# EasyEDA Pro project FlasherPanel.epro

# Schematic Schematic1
Board Name: Board1; Create Date: 2025-02-24; Page Name: P1; Project Name: FlasherBoard; Schematic Name: Schematic1; Update Date: 2025-02-25; Company: EasyEDA.com; Page Size: A4; Version: V1.0
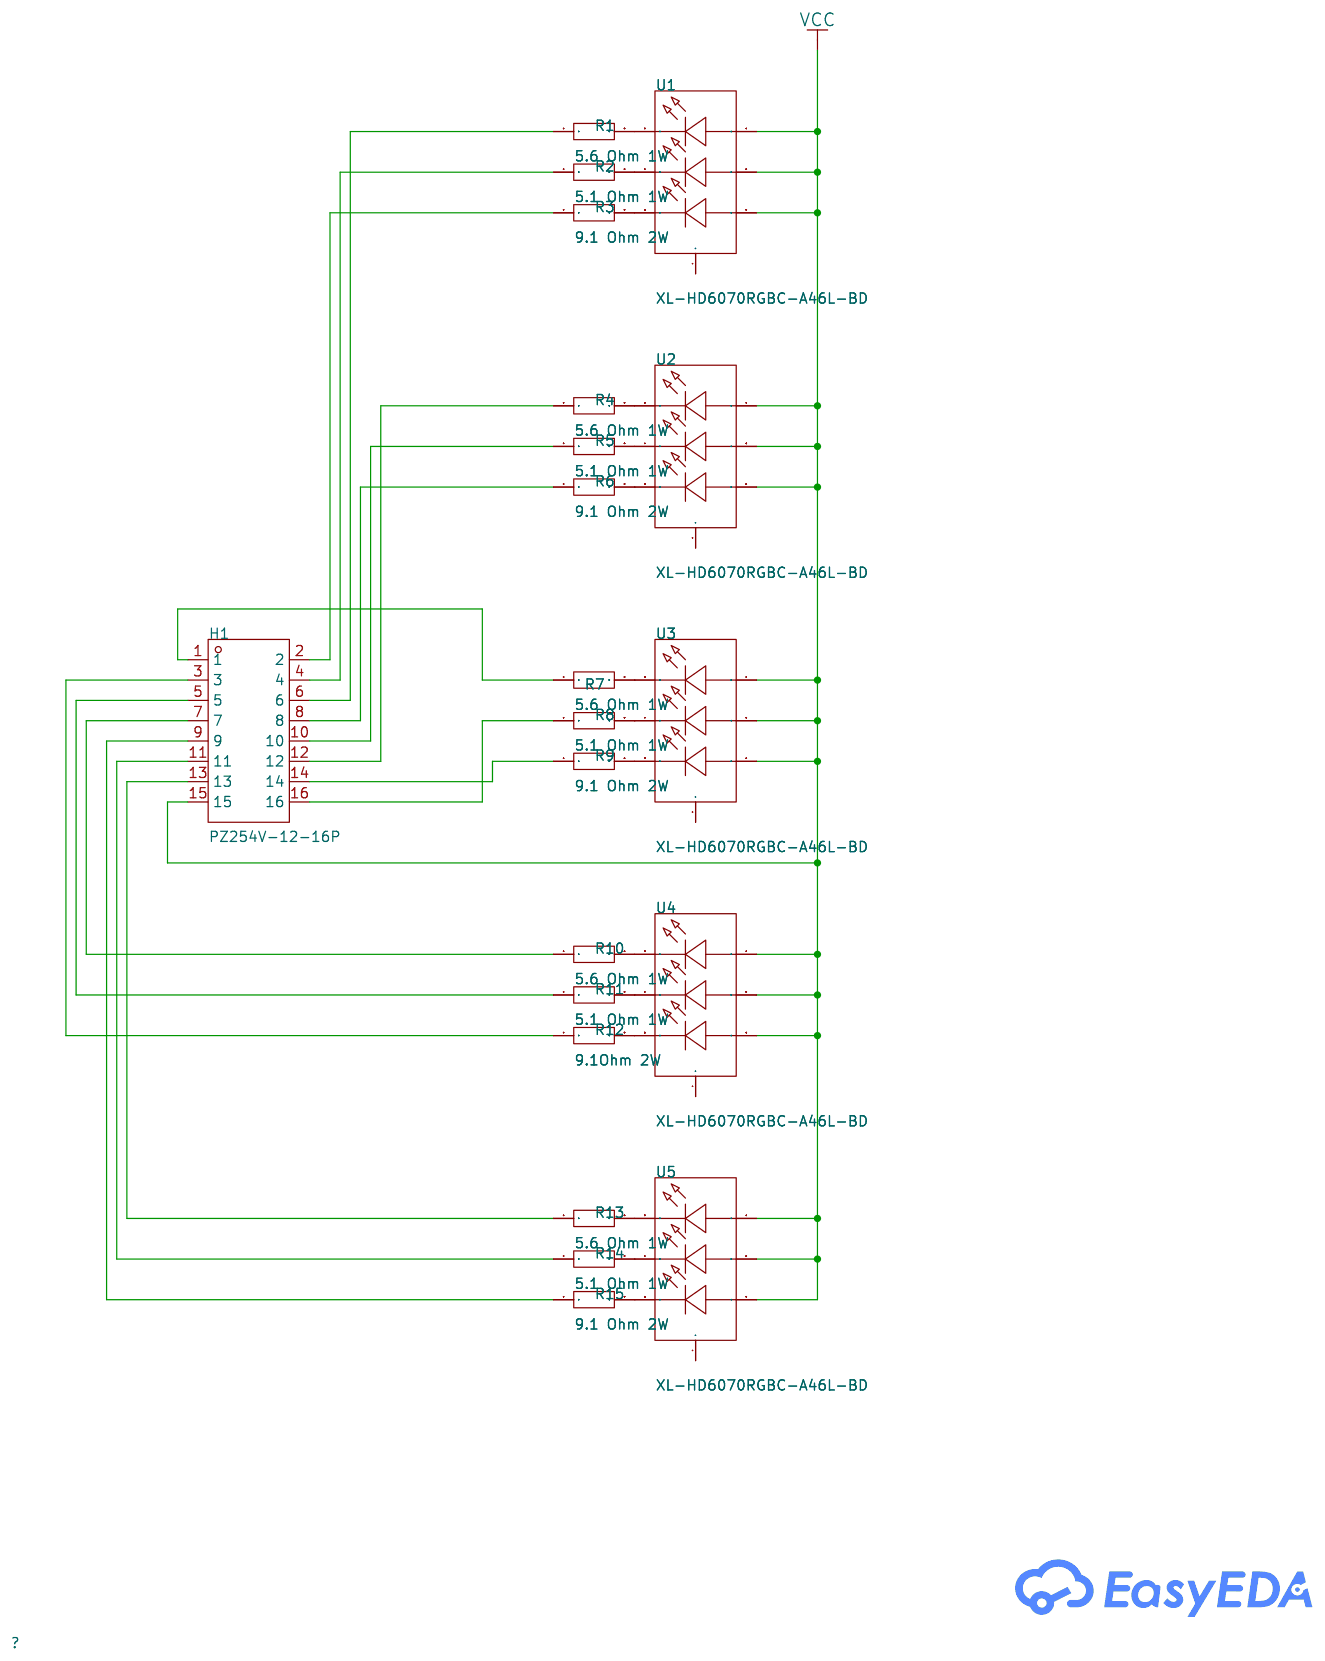
[diagram p0: schematic sheet]

## Parts
H1  PZ254V-12-16P  [HDR-TH_16P-P2.54-V-M-R2-C8-S2.54]
R1  5.6 Ohm 1W  [R2512]
R2  5.1 Ohm 1W  [R2512]
R3  9.1 Ohm 2W  [R2512]
R4  5.6 Ohm 1W  [R2512]
R5  5.1 Ohm 1W  [R2512]
R6  9.1 Ohm 2W  [R2512]
R7  5.6 Ohm 1W  [R2512]
R8  5.1 Ohm 1W  [R2512]
R9  9.1 Ohm 2W  [R2512]
R10  5.6 Ohm 1W  [R2512]
R11  5.1 Ohm 1W  [R2512]
R12  9.1Ohm 2W  [R2512]
R13  5.6 Ohm 1W  [R2512]
R14  5.1 Ohm 1W  [R2512]
R15  9.1 Ohm 2W  [R2512]
U1  XL-HD6070RGBC-A46L-BD  [LED-SMD_6P-BD8.0-LS14.5]
U2  XL-HD6070RGBC-A46L-BD  [LED-SMD_6P-BD8.0-LS14.5]
U3  XL-HD6070RGBC-A46L-BD  [LED-SMD_6P-BD8.0-LS14.5]
U4  XL-HD6070RGBC-A46L-BD  [LED-SMD_6P-BD8.0-LS14.5]
U5  XL-HD6070RGBC-A46L-BD  [LED-SMD_6P-BD8.0-LS14.5]

## Library data of the parts
H1 = PZ254V-12-16P: Pin Structure:2x8P Pitch:2.54mm Row Spacing:2.54mm Circluar Pins/Square Pins:Square Pins Mounting Type:Straight Number of Rows:双排 Number of Pins:16P Current Rating (Max):- Voltage Rating (Max):- Length of Mating Pin:6mm Insulation Height:2.5mm Length of E; LCSC Part Name: 间距:2.54mm 2x8P 直插 方针; Supplier Part: C492425; Manufacturer: XFCN(兴飞); Supplier Footprint: 插件,P=2.54mm; JLCPCB Part Class: Extended Part; Datasheet: https://atta.szlcsc.com/upload/public/pdf/source/20200309/C492425_0A00EE06259AD0A0AB9C88167BB69964.pdf; Supplier: LCSC; Pin Structure: 2x8P; Pitch: 2.54mm; Row Spacing: 2.54mm; Circluar Pins/Square Pins: Square Pins; Mounting Type: Straight; Number of Rows: 双排; Number of Pins: 16P; Length of Mating Pin: 6mm; Insulation Height: 2.5mm; Length of End Connection Pin: 3mm; Operating Temperature Range: -40℃~+105℃; Color: Black
R1-R3 = Res_0603: Supplier Footprint: 0603
R4-R15 = CRG1206F10K: Type:Thick Film Resistors Resistance: Tolerance:±1% Tolerance:±1% Power(Watts):250mW Overload Voltage (Max): Temperature Coefficient:±100ppm/℃ Temperature Coefficient:±100ppm/℃ Operating Temperature Range:-55℃~+155℃ Operating Temperature Range:-55℃~+155℃; LCSC Part Name: 厚膜电阻 10kΩ ±1% 250mW; Supplier Part: C2074481; Manufacturer: TE Connectivity(泰科电子); Supplier Footprint: 1206; JLCPCB Part Class: Extended Part; Datasheet: https://atta.szlcsc.com/upload/public/pdf/source/20210608/D95D7196C11938F01E5013E79A9A3DFC.pdf; Supplier: LCSC; Type: Thick Film Resistors; Tolerance: ±1%; Power(Watts): 250mW; Temperature Coefficient: ±100ppm/℃; Operating Temperature Range: -55℃~+155℃; FootprintName: R0603
U1-U5 = XL-HD6070RGBC-A46L-BD: LCSC Part Name: 球头七彩; Supplier Part: C22434861; Manufacturer: XINGLIGHT(成兴光); Supplier Footprint: SMD8080-6P; JLCPCB Part Class: Extended Part; Datasheet: https://atta.szlcsc.com/upload/public/pdf/source/20240516/D3778ABDB5CABE9CC0417A8C2EA1DFA9.pdf; Supplier: LCSC

## Nets
VCC: H1.15 U1.1(A) U1.3(A) U1.5(A) U2.1(A) U2.3(A) U2.5(A) U3.1(A) U3.3(A) U3.5(A) U4.1(A) U4.3(A) U4.5(A) U5.1(A) U5.3(A) U5.5(A)
$1N971: R1.2 U1.2(K)
$1N997: R2.2 U1.4(K)
$1N1023: R3.2 U1.6(K)
$1N1049: R4.2 U2.2(K)
$1N1075: R5.2 U2.4(K)
$1N1101: R6.2 U2.6(K)
$1N1151: R8.2 U3.4(K)
$1N1177: R9.2 U3.6(K)
$1N1203: R10.2 U4.2(K)
$1N1229: R11.2 U4.4(K)
$1N1255: R12.2 U4.6(K)
$1N1281: R13.2 U5.2(K)
$1N1307: R14.2 U5.4(K)
$1N1333: R15.2 U5.6(K)
$1N1359: R7.2 U3.2(K)
Net-(H1-1): H1.1 R7.1
Net-(H1-2): H1.2 R3.1
Net-(H1-3): H1.3 R12.1
Net-(H1-4): H1.4 R2.1
Net-(H1-5): H1.5 R11.1
Net-(H1-6): H1.6 R1.1
Net-(H1-7): H1.7 R10.1
Net-(H1-8): H1.8 R6.1
Net-(H1-9): H1.9 R15.1
Net-(H1-10): H1.10 R5.1
Net-(H1-11): H1.11 R14.1
Net-(H1-12): H1.12 R4.1
Net-(H1-13): H1.13 R13.1
Net-(H1-14): H1.14 R9.1
Net-(H1-16): H1.16 R8.1

Not connected (* = marked no-connect by the designer): U1 7; U2 7; U3 7; U4 7; U5 7

# Board PCB1
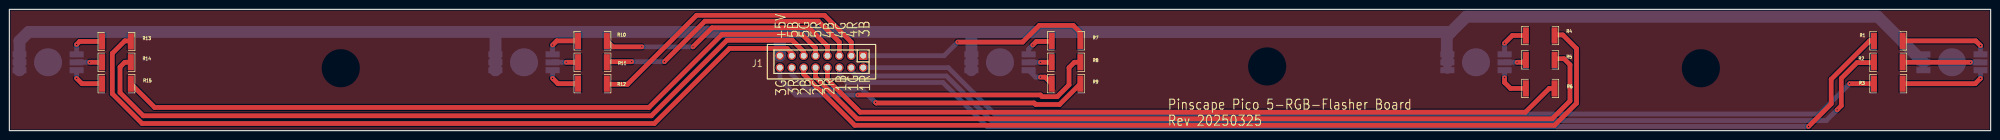
[diagram p1: board, top side]
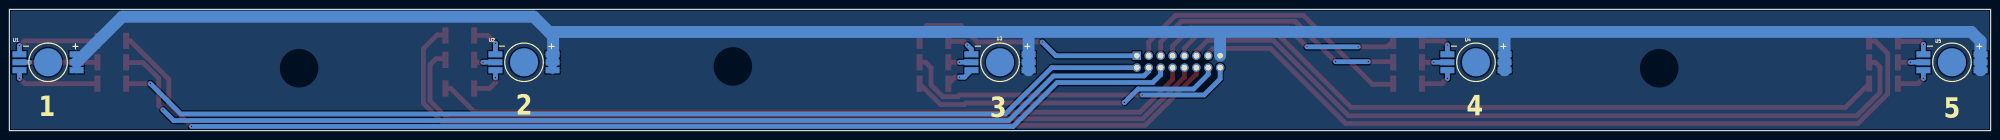
[diagram p2: board, bottom side, seen from below]

Outline 422.91 x 25.91 mm; copper layers: Top Layer, Bottom Layer. Coordinates in mm from the lower left corner of the outline.
Outline path: rectangle 0,25.91 422.91,0
Stack: Top Layer 0.035mm / Dielectric1 1.51mm FR4 er 4.5 / Bottom Layer 0.035mm

## Design rules (mm)
template: JLCPCB Capability(Two Layers Board)
spacing copperThickness1oz (default): track to track 0.102, other pairs 0.152 to 0.3
spacing copperThickness2oz: track to track 0.203, other pairs 0.152 to 0.3
track width copperThickness1oz (default): min 0.127, default 0.254, max 2.54
track width copperThickness2oz: min 0.203, default 0.254, max 2.54
differential pair differentialPair (default): width min 0.127, default 0.254, max 2.54; gap min 0.152, default 0.152
via viaSize (default): diameter min 0.5, default 0.61, max 10; hole min 0.3, default 0.305, max 6.3

## Placement (name value [footprint] x y rotation side)
J1  PZ254V-12-16P  [HDR-TH_16P-P2.54-V-M-R2-C8-S2.54]  173.35 14.73 180 top
R1  5.6 Ohm 1W  [R2512]  401.07 19.18 0 top
R2  5.1 Ohm 1W  [R2512]  401.07 14.6 0 top
R3  9.1 Ohm 2W  [R2512]  401.07 10.03 0 top
R4  5.6 Ohm 1W  [R2512]  326.77 20.32 180 top
R5  5.1 Ohm 1W  [R2512]  326.77 15.11 180 top
R6  9.1 Ohm 2W  [R2512]  326.77 9.02 180 top
R7  5.6 Ohm 1W  [R2512]  225.55 19.18 180 top
R8  5.1 Ohm 1W  [R2512]  225.55 14.6 180 top
R9  9.1 Ohm 2W  [R2512]  225.55 10.03 180 top
R10  5.6 Ohm 1W  [R2512]  124.46 19.18 180 top
R11  5.1 Ohm 1W  [R2512]  124.46 14.6 180 top
R12  9.1Ohm 2W  [R2512]  124.46 10.03 180 top
R13  5.6 Ohm 1W  [R2512]  22.86 19.05 180 top
R14  5.1 Ohm 1W  [R2512]  22.86 14.6 180 top
R15  9.1 Ohm 2W  [R2512]  22.86 10.03 180 top
U1  XL-HD6070RGBC-A46L-BD  [LED-SMD_6P-BD8.0-LS14.5]  414.66 14.6 180 bottom
U2  XL-HD6070RGBC-A46L-BD  [LED-SMD_6P-BD8.0-LS14.5]  313.06 14.6 180 bottom
U3  XL-HD6070RGBC-A46L-BD  [LED-SMD_6P-BD8.0-LS14.5]  211.46 14.6 180 bottom
U4  XL-HD6070RGBC-A46L-BD  [LED-SMD_6P-BD8.0-LS14.5]  109.86 14.6 180 bottom
U5  XL-HD6070RGBC-A46L-BD  [LED-SMD_6P-BD8.0-LS14.5]  8.26 14.6 180 bottom

## Footprints (pads in the part's own frame, mm; a bottom-side part is the same pattern mirrored in y, then rotated)
HDR-TH_16P-P2.54-V-M-R2-C8-S2.54
  rect 1.8x1.8 hole 1.2: 1(-8.89,-1.27)
  round 1.8 hole 1.2: 2(-8.89,1.27) 3(-6.35,-1.27) 4(-6.35,1.27) 5(-3.81,-1.27) 6(-3.81,1.27) 7(-1.27,-1.27) 8(-1.27,1.27) 9(1.27,-1.27) 10(1.27,1.27) 11(3.81,-1.27) 12(3.81,1.27) 13(6.35,-1.27) 14(6.35,1.27) 15(8.89,-1.27) 16(8.89,1.27)
LED-SMD_6P-BD8.0-LS14.5
  rect 3x1.3 smd: 1(6.1,1.7) 2(-6.1,1.7) 3(6.1,0) 4(-6.1,0) 5(6.1,-1.7) 6(-6.1,-1.7)
  round 6 smd: 7(0,0)
R2512
  rect 1.282x3.456 smd: 1(-3.067,0) 2(3.067,0)

## Nets
VCC: J1.15 U1.1 U1.3 U1.5 U2.1 U2.3 U2.5 U3.1 U3.3 U3.5 U4.1 U4.3 U4.5 U5.1 U5.3 U5.5
$1N971: R1.2 U1.2
$1N997: R2.2 U1.4
$1N1023: R3.2 U1.6
$1N1049: R4.2 U2.2
$1N1075: R5.2 U2.4
$1N1101: R6.2 U2.6
$1N1151: R8.2 U3.4
$1N1177: R9.2 U3.6
$1N1203: R10.2 U4.2
$1N1229: R11.2 U4.4
$1N1255: R12.2 U4.6
$1N1281: R13.2 U5.2
$1N1307: R14.2 U5.4
$1N1333: R15.2 U5.6
$1N1359: R7.2 U3.2
$1N2618: J1.2 R3.1
$1N2624: J1.4 R2.1
$1N2631: J1.6 R1.1
$1N2638: J1.12 R4.1
$1N2658: J1.14 R9.1
$1N2665: J1.16 R8.1
$1N2672: J1.1 R7.1
$1N2681: J1.3 R12.1
$1N2688: J1.5 R11.1
$1N2695: J1.7 R10.1
$1N2713: J1.9 R15.1
$1N2719: J1.11 R14.1
$1N2726: J1.13 R13.1
$1N3303: J1.8 R6.1
$1N3309: J1.10 R5.1

Pads without a net: U1 7; U2 7; U3 7; U4 7; U5 7

## Via types
v1: diameter 0.61, hole 0.305, Top Layer to Bottom Layer, 25 vias

## Routing (per net, layer and track width the routed paths; a pad name or vN(x,y) marks a point on that pad's centre or on a via; arc(x,y) is an arc through that point)
VCC: length 452
  Bottom Layer w1.016: U1.5 U1.3 U1.1
  Bottom Layer w1.524: U2.3 U2.5
  Bottom Layer w2.54: 104.39,21.08 4.1,21.08 2.16,19.14 2.16,12.91 U5.5 ; 104.39,21.08 103.76,20.45 103.76,12.91 U4.5 ; 104.39,21.08 164.47,21.08 ; U2.3 U2.1 306.83,16.43 306.83,20.19 307.63,20.99 ; 164.47,21.08 J1.15 ; 164.47,21.08 204.88,21.08 ; 307.63,20.99 307.54,21.08 205.36,21.08 U3.1 U3.3 U3.5 ; 307.63,20.99 310.98,24.34 398.82,24.34 U1.3
$1N971: length 18.9
  Top Layer w1.016: v1(420.75,18.16) 419.74,19.18 R1.2
  Bottom Layer w1.016: U1.2 420.75,18.16 v1(420.75,18.16)
$1N997: length 16.6
  Top Layer w1.016: R2.2 v1(418.59,14.6)
  Bottom Layer w1.016: v1(418.59,14.6) U1.4
$1N1023: length 18.8
  Top Layer w1.016: R3.2 419.61,10.03 v1(420.75,11.18)
  Bottom Layer w1.016: U1.6 420.75,11.18 v1(420.75,11.18)
$1N1049: length 7.6
  Top Layer w1.016: v1(319.15,18.67) 320.8,20.32 R4.2
  Bottom Layer w1.016: U2.2 319.16,18.66 v1(319.15,18.67)
$1N1075: length 4.8
  Top Layer w1.016: v1(321.82,14.6) 323.2,14.6 R5.2
  Bottom Layer w1.016: v1(321.82,14.6) U2.4
$1N1101: length 7.7
  Top Layer w1.016: R6.2 320.42,9.02 319.15,10.29 v1(319.15,11.3)
  Bottom Layer w1.016: U2.6 319.16,11.31 v1(319.15,11.3)
$1N1151: length 4.9
  Top Layer w1.016: v1(220.09,14.6) R8.2
  Bottom Layer w1.016: U3.4 v1(220.09,14.6)
$1N1177: length 6.1
  Top Layer w1.016: v1(220.09,11.43) 221.09,11.43 R9.2
  Bottom Layer w1.016: U3.6 219.03,11.43 v1(220.09,11.43)
$1N1203: length 7.8
  Top Layer w1.016: R10.2 116.84,19.18 v1(115.95,18.29)
  Bottom Layer w1.016: U4.2 115.95,16.31 v1(115.95,18.29)
$1N1229: length 5.4
  Top Layer w1.016: R11.2 v1(118.87,14.6)
  Bottom Layer w1.016: v1(118.87,14.6) U4.4
$1N1255: length 7.6
  Top Layer w1.016: v1(115.95,11.18) 117.09,10.03 R12.2
  Bottom Layer w1.016: v1(115.95,11.18) 115.96,11.18 U4.6
$1N1281: length 7.8
  Top Layer w1.016: v1(14.35,18.41) 14.99,19.05 R13.2
  Bottom Layer w1.016: U5.2 14.36,18.41 v1(14.35,18.41)
$1N1307: length 5.4
  Top Layer w1.016: R14.2 v1(17.15,14.6)
  Bottom Layer w1.016: v1(17.15,14.6) U5.4
$1N1333: length 7.6
  Top Layer w1.016: v1(14.35,11.18) 15.49,10.03 R15.2
  Bottom Layer w1.016: v1(14.35,11.18) 14.36,11.18 U5.6
$1N1359: length 6.8
  Top Layer w1.016: v1(218.44,18.29) 219.2,19.05 222.36,19.05 R7.2
  Bottom Layer w1.016: U3.2 217.56,17.4 v1(218.44,18.29)
$1N2618: length 222.5
  Top Layer w1.016: v1(392.81,10.03) R3.1
  Bottom Layer w1.016: 182.25,13.46 200.41,13.46 210.31,3.56 386.33,3.56 v1(392.81,10.03)
$1N2624: length 232
  Top Layer w1.016: R2.1 397.93,14.53 394.39,14.53 391.03,11.18 391.03,5.33 v1(390.14,4.44)
  Bottom Layer w1.016: 179.71,13.46 179.71,12.7 180.72,11.68 200.03,11.68 209.55,2.16 387.86,2.16 v1(390.14,4.44)
$1N2631: length 237.6
  Top Layer w1.016: v1(384.05,0.89) 388.87,5.71 388.87,10.98 397.07,19.18 R1.1
  Bottom Layer w1.016: v1(384.05,0.89) 208.66,0.89 199.26,10.29 178.83,10.29 177.16,11.95 177.16,13.46
$1N2638: length 190.5
  Top Layer w1.016: R4.1 329.96,20.45 331.6,20.45 334.52,17.53 334.52,5.84 329.82,1.14 180.47,1.14 169.55,12.06 169.55,13.46
$1N2658: length 67.6
  Top Layer w1.016: R9.1 224.17,5.59 219.08,5.59 218.76,5.91 185.04,5.91 v1(184.91,6.03)
  Bottom Layer w1.016: 167,13.46 167,12.02 170.14,8.89 181.99,8.89 184.85,6.03 v1(184.91,6.03)
$1N2665: length 73.3
  Top Layer w1.016: v1(181.1,7.62) 220.09,7.62 220.45,7.26 223.67,7.26 226.19,9.78 226.19,13.46 227.33,14.6 R8.1
  Bottom Layer w1.016: 164.47,13.46 164.47,11.05 167.89,7.62 v1(181.1,7.62)
$1N2672: length 51.5
  Top Layer w1.016: R7.1 228.62,20.94 227.08,22.48 219.84,22.48 216.28,18.92 v1(202.44,18.92)
  Bottom Layer w1.016: v1(202.44,18.92) 199.52,16 J1.1
$1N2681: length 63.6
  Top Layer w1.016: R12.1 127.65,9.91 131.95,9.91 146.69,24.64 173.99,24.64 179.71,18.92 J1.3
$1N2688: length 58
  Top Layer w1.016: v1(139.83,14.73) 148.46,23.37 172.72,23.37 177.16,18.92 J1.5 ; v1(132.84,14.73) 127.65,14.73 R11.1
  Bottom Layer w1.016: v1(139.83,14.73) v1(132.84,14.73)
$1N2695: length 53
  Top Layer w1.016: v1(135,17.91) 128.8,17.91 R10.1 ; v1(145.92,17.91) 149.99,21.97 170.69,21.97 174.62,18.03 J1.7
  Bottom Layer w1.016: v1(145.92,17.91) v1(135,17.91)
$1N2713: length 157.6
  Top Layer w1.016: R15.1 31.01,4.95 136.53,4.95 152.15,20.57 169.16,20.57 172.09,17.65 J1.9
$1N2719: length 164.7
  Top Layer w1.016: R14.1 24.64,14.6 23.62,13.59 23.62,8.13 28.58,3.17 137.03,3.17 153.16,19.3 167.13,19.3 169.55,16.89 J1.11
$1N2726: length 169
  Top Layer w1.016: J1.13 167,16.55 165.99,17.56 153.71,17.56 137.67,1.52 28.32,1.52 21.97,7.87 21.97,16.51 24.64,19.18 25.8,19.18 R13.1
$1N3303: length 162.7
  Top Layer w1.016: R6.1 328.68,9.02 323.6,3.94 181.61,3.94 174.62,10.92 174.62,13.46
$1N3309: length 180
  Top Layer w1.016: 172.09,13.46 172.09,11.43 180.97,2.54 329.31,2.54 333.12,6.35 333.12,14.1 331.85,15.37 330.09,15.37 R5.1

## Copper pours and planes (outline as drawn; the poured copper is in the pictures)
VCC on Top Layer: -1.97,28.96 422.08,28.96 422.08,1.02 -1.97,1.02
VCC on Top Layer: -0.38,26.54 423.04,26.54 423.04,-0.38 -0.38,-0.38
VCC on Bottom Layer: -0.51,26.67 423.55,26.67 423.55,-1.27 -0.51,-1.27

## Text on the board
Bottom Silkscreen Layer: 5 | 4 | 3 | 2 | 1
Top Silkscreen Layer: Pinscape Pico 5-RGB-Flasher Board / Rev 20250325 | +5V | 3G | 5B | 3R | 5G | 2B | 5R | 2G | 4B | 2R | 4G | 1B | 4R | 1G | 3B | 1R
